# Altium project nPOC-BB_alpha_main-board.PrjPcb (part 1 of 3)
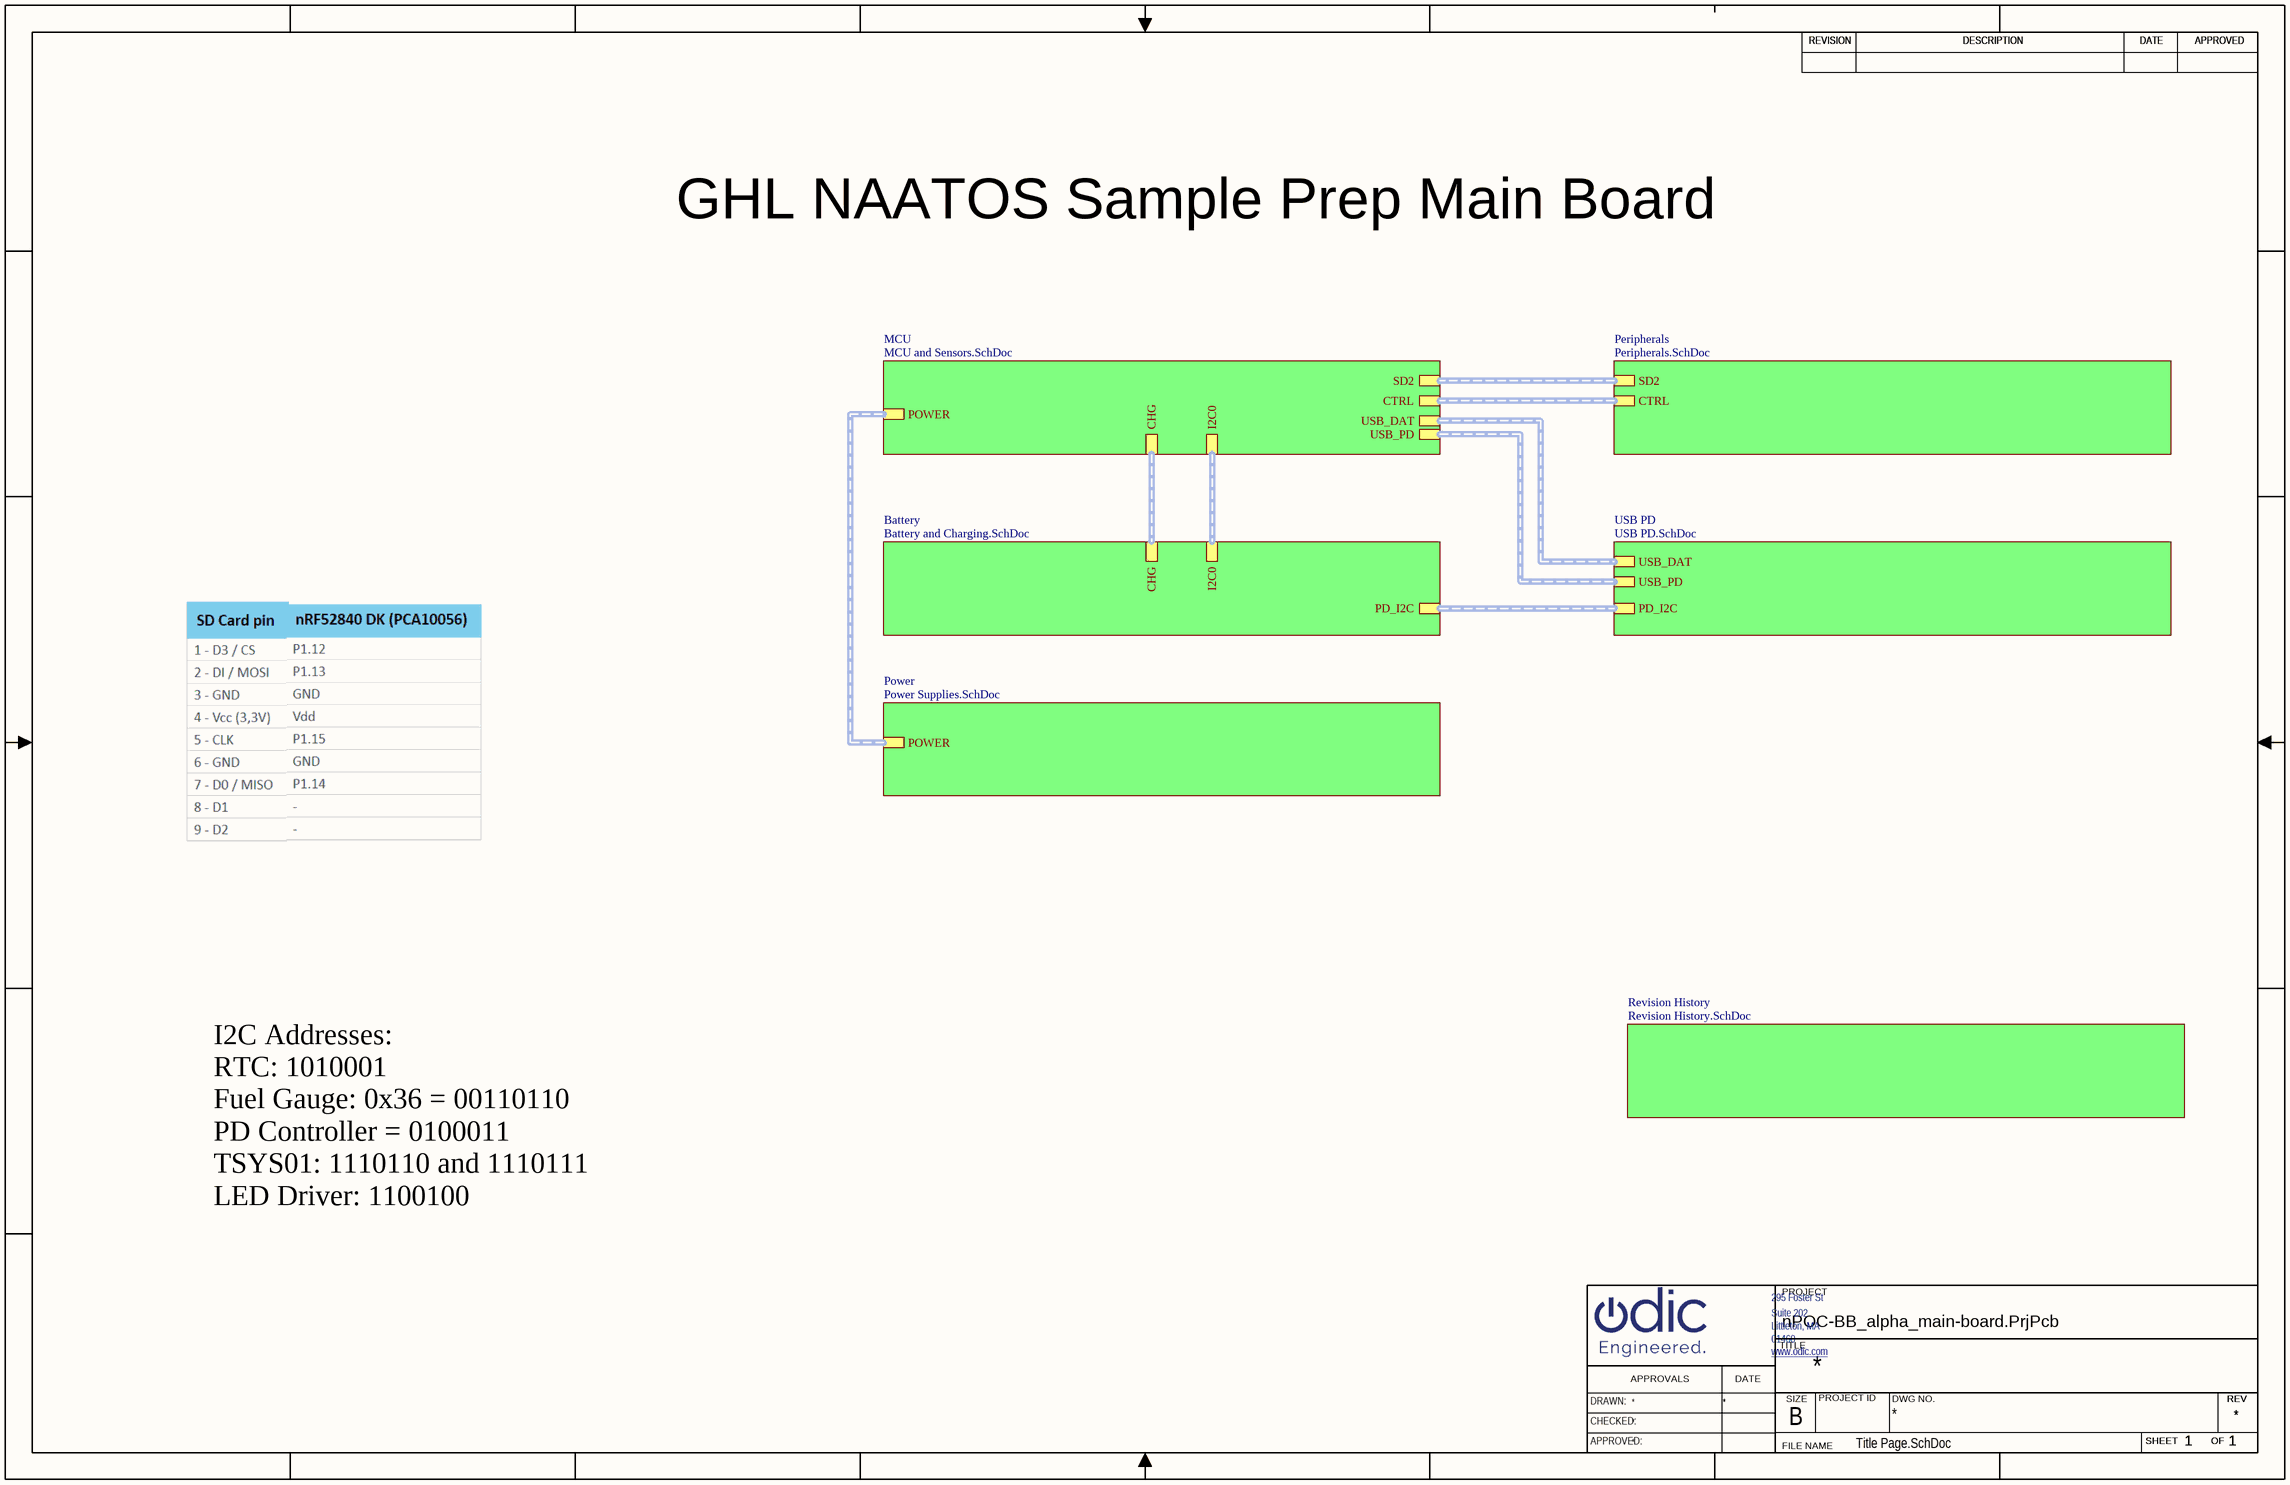
[diagram p0: Title Page.SchDoc]
7 sheets, 195 parts. Net scope: hierarchical (ports join the sheet entries above them; power ports are global).
Board file: nPOC-BB_alpha_main-boardd.PcbDoc
Sheets:
  Title Page.SchDoc
    MCU = MCU and Sensors.SchDoc
    Battery = Battery and Charging.SchDoc
    Revision History = Revision History.SchDoc
    Power = Power Supplies.SchDoc
    Peripherals = Peripherals.SchDoc
    USB PD = USB PD.SchDoc

## Sheet Title Page.SchDoc
size 431 x 279 mm; SheetNumber: 1; SheetTotal: 1

### Sub-sheets
Battery = Battery and Charging.SchDoc: CHG, I2C0, PD_I2C
MCU = MCU and Sensors.SchDoc: CHG, CTRL, POWER, USB_PD, SD2, USB_DAT, I2C0
Peripherals = Peripherals.SchDoc: CTRL, SD2
Power = Power Supplies.SchDoc: POWER
Revision History = Revision History.SchDoc: no entries
USB PD = USB PD.SchDoc: USB_PD, PD_I2C, USB_DAT

### Buses and harness runs
harness sheet Battery/CHG = sheet MCU/CHG
harness sheet Battery/I2C0 = sheet MCU/I2C0
harness sheet Battery/PD_I2C = sheet USB PD/PD_I2C
harness sheet MCU/CTRL = sheet Peripherals/CTRL
harness sheet MCU/POWER = sheet Power/POWER
harness sheet MCU/SD2 = sheet Peripherals/SD2
harness sheet MCU/USB_DAT = sheet USB PD/USB_DAT
harness sheet MCU/USB_PD = sheet USB PD/USB_PD

### Notes on the sheet
- GHL NAATOS Sample Prep Main Board
- I2C Addresses:
  RTC: 1010001
  Fuel Gauge: 0x36 = 00110110
  PD Controller = 0100011
  TSYS01: 1110110 and 1110111
  LED Driver: 1100100
- REVISION
- DESCRIPTION
- DATE
- APPROVED
- 295 Foster St
- PROJECT
- www.odic.com <http://www.odic.com>
- Littleton, MA
- 01460
- Suite 202
- TITLE
- DRAWN:
- CHECKED:
- APPROVALS
- SIZE
- B
- PROJECT ID
- DWG NO.
- SHEET
- OF
- REV
- APPROVED:
- FILE NAME

## Sheet MCU and Sensors.SchDoc: MCU and Sensors
size 431 x 279 mm; DrawnBy: DD; DocumentNumber: GHL-1-21002; Revision: A; SheetNumber: 2; SheetTotal: 7; ProjectID: 263-03
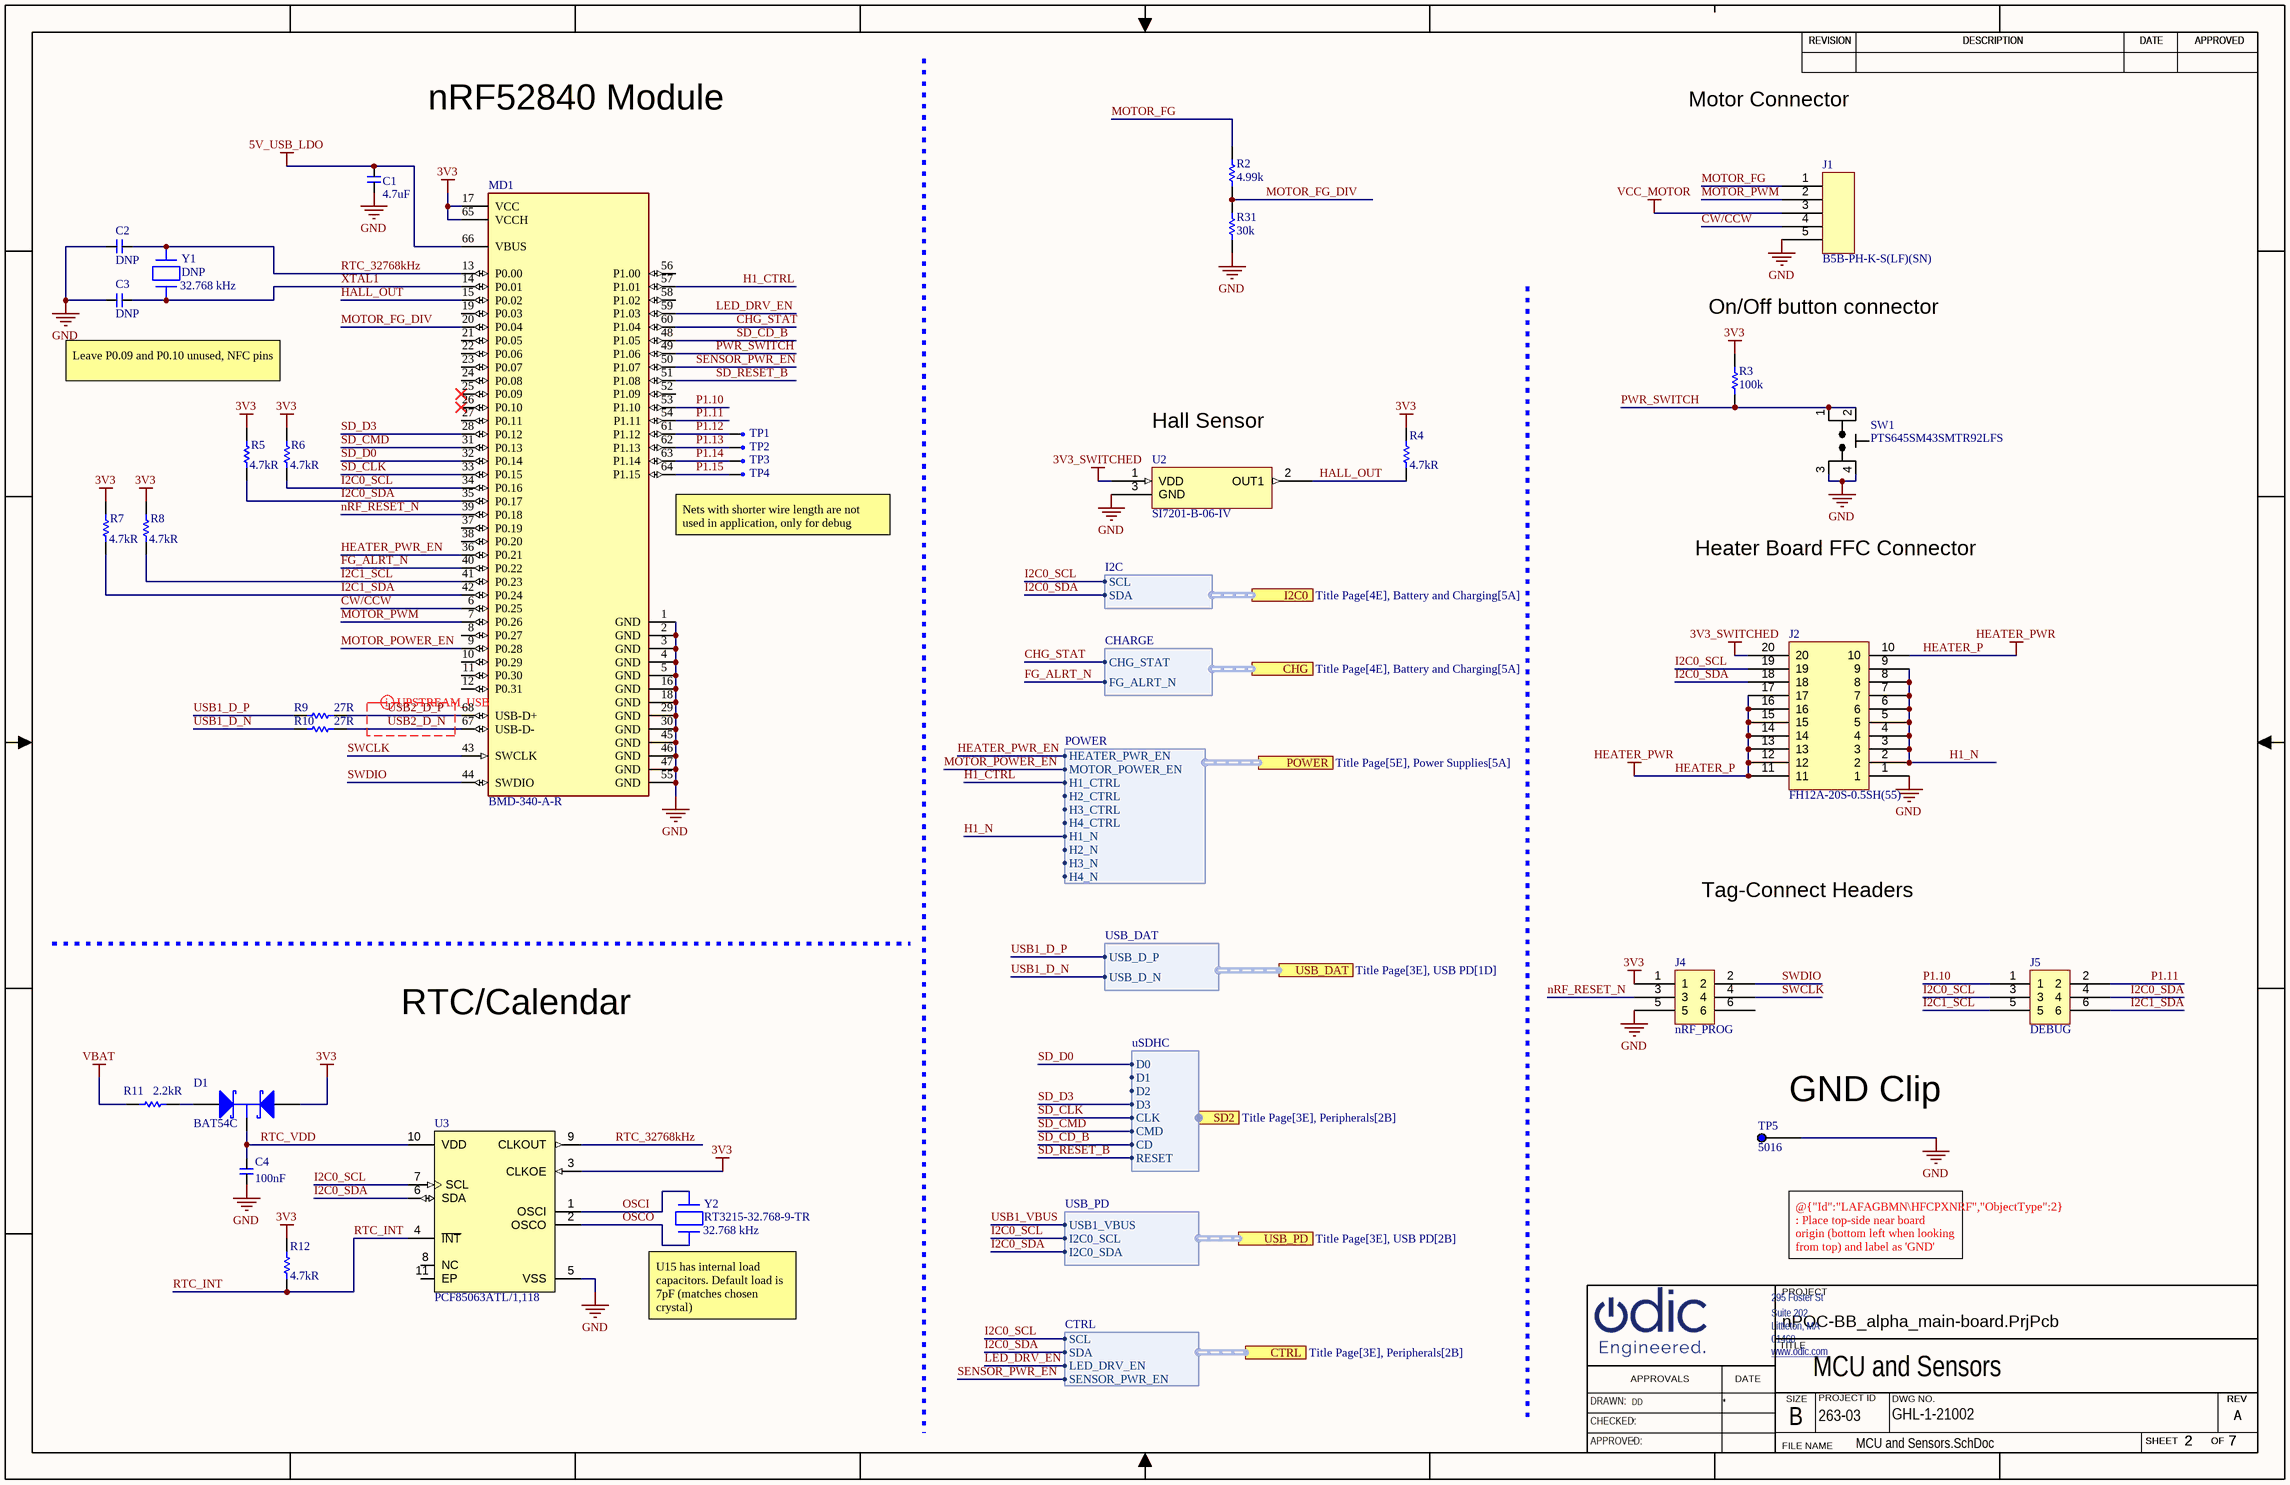
[diagram p1: MCU and Sensors.SchDoc]

### Parts
C1  4.7uF  [C0603]
C2  DNP  [C0402]
C3  DNP  [C0402]
C4  Capacitance: 100nF  [C0402]  (hidden comment: C0402_100n_16V_10pct)
D1  BAT54C  [SOT23]
J1  B5B-PH-K-S(LF)(SN)  [JST_B5B-PH-K-S]
J2  FH12A-20S-0.5SH(55)  [hirose_fh12a-20s-0p5sh55]
J4  nRF_PROG  [tc2030-mcp-nl]
J5  DEBUG  [tc2030-mcp-nl]
MD1  BMD-340-A-R  [BMD-340-A-R]
R2  4.99k  [R0402]
R3  100k  [R0402]
R4  Resistance: 4.7kR  [R0402]  (hidden comment: R0402_4k7_1pct)
R5  Resistance: 4.7kR  [R0402]  (hidden comment: R0402_4k7_1pct)
R6  Resistance: 4.7kR  [R0402]  (hidden comment: R0402_4k7_1pct)
R7  Resistance: 4.7kR  [R0402]  (hidden comment: R0402_4k7_1pct)
R8  Resistance: 4.7kR  [R0402]  (hidden comment: R0402_4k7_1pct)
R9  27R  [R0402]
R10  27R  [R0402]
R11  Resistance: 2.2kR  [R0402]  (hidden comment: R0402_2k2_5pct)
R12  Resistance: 4.7kR  [R0402]  (hidden comment: R0402_4k7_1pct)
R31  30k  [R0402]
SW1  PTS645SM43SMTR92LFS  [swt_pb_pts645s]
TP1  TPC30  [tpc30]  (value not drawn)
TP2  TPC30  [tpc30]  (value not drawn)
TP3  TPC30  [tpc30]  (value not drawn)
TP4  TPC30  [tpc30]  (value not drawn)
TP5  5016  [KEYSTONE_5016]
U2  SI7201-B-06-IV  [SOT23]
U3  PCF85063ATL/1,118  [dfn10_2p6x2p6_p5mm]
Y1  DNP  Operating Frequency: 32.768 kHz  [xtal2_3p2x1p5]
Y2  RT3215-32.768-9-TR  Operating Frequency: 32.768 kHz  [xtal2_3p2x1p5]

### Ports
CHG (harness CHARGE, see Title Page[4E], Battery and Charging[5A]), CTRL (harness CTRL, see Title Page[3E], Peripherals[2B]), I2C0 (harness I2C, see Title Page[4E], Battery and Charging[5A]), POWER (harness POWER, see Title Page[5E], Power Supplies[5A]), SD2 (harness uSDHC, see Title Page[3E], Peripherals[2B]), USB_DAT (harness USB_DAT, see Title Page[3E], USB PD[1D]), USB_PD (harness USB_PD, see Title Page[3E], USB PD[2B])

### Harnesses
CTRL: SCL, SDA, LED_DRV_EN, SENSOR_PWR_EN
USB_PD: USB1_VBUS, I2C0_SCL, I2C0_SDA
uSDHC: D0, D1, D2, D3, CLK, CMD, CD, RESET
USB_DAT: USB_D_P, USB_D_N
I2C: SCL, SDA
CHARGE: CHG_STAT, FG_ALRT_N
POWER: HEATER_PWR_EN, H1_CTRL, H2_CTRL, H3_CTRL, H4_CTRL, H1_N, H2_N, H3_N, H4_N, MOTOR_POWER_EN

### Nets
3V3: D1.2(A2) J4.1 MD1.17(VCC) MD1.65(VCCH) R3.2 R4.2 R5.2 R6.2 R7.2 R8.2 R12.2 U3.3(CLKOE)
3V3_SWITCHED: J2.20 U2.1(VDD)
5V_USB_LDO: C1.2 MD1.66(VBUS)
GND: C1.1 C2.1 C3.1 C4.2 J1.5 J2.1 J4.5 MD1.1(GND) MD1.2(GND) MD1.3(GND) MD1.4(GND) MD1.5(GND) MD1.16(GND) MD1.18(GND) MD1.29(GND) MD1.30(GND) MD1.45(GND) MD1.46(GND) MD1.47(GND) MD1.55(GND) R31.1 SW1.3 SW1.4 TP5.1 U2.3(GND) U3.5(VSS)
HEATER_P: J2.10 J2.11 J2.12 J2.13 J2.14 J2.15 J2.16 J2.17  [also labelled HEATER_PWR]
VBAT: R11.1
VCC_MOTOR: J1.3
CHG_STAT: MD1.60(P1.04) ; port CHG.CHG_STAT
CW/CCW: J1.4 MD1.6(P0.25)
FG_ALRT_N: MD1.40(P0.22) ; port CHG.FG_ALRT_N
H1_CTRL: MD1.57(P1.01) ; port POWER.H1_CTRL
H1_N: J2.2 J2.3 J2.4 J2.5 J2.6 J2.7 J2.8 J2.9 ; port POWER.H1_N
HALL_OUT: MD1.15(P0.02) R4.1 U2.2(OUT1)
HEATER_PWR_EN: MD1.36(P0.21) ; port POWER.HEATER_PWR_EN
I2C0_SCL: J2.19 J5.3 MD1.34(P0.16) R6.1 U3.7(SCL) ; port CTRL.SCL, port USB_PD.I2C0_SCL, port I2C0.SCL
I2C0_SDA: J2.18 J5.4 MD1.35(P0.17) R5.1 U3.6(SDA) ; port CTRL.SDA, port USB_PD.I2C0_SDA, port I2C0.SDA
I2C1_SCL: J5.5 MD1.41(P0.23) R8.1
I2C1_SDA: J5.6 MD1.42(P0.24) R7.1
LED_DRV_EN: MD1.59(P1.03) ; port CTRL.LED_DRV_EN
MOTOR_FG: J1.1 R2.2
MOTOR_FG_DIV: MD1.20(P0.04) R2.1 R31.2
MOTOR_POWER_EN: MD1.9(P0.28) ; port POWER.MOTOR_POWER_EN
MOTOR_PWM: J1.2 MD1.7(P0.26)
nRF_RESET_N: J4.3 MD1.39(P0.18)
OSCI: U3.1(OSCI) Y2.1
OSCO: U3.2(OSCO) Y2.2
P1.10: J5.1 MD1.53(P1.10)
P1.11: J5.2 MD1.54(P1.11)
P1.12: MD1.61(P1.12) TP1.1
P1.13: MD1.62(P1.13) TP2.1
P1.14: MD1.63(P1.14) TP3.1
P1.15: MD1.64(P1.15) TP4.1
PWR_SWITCH: MD1.49(P1.06) R3.1 SW1.1 SW1.2
RTC_32768kHz: C2.2 MD1.13(P0.00) U3.9(CLKOUT) Y1.1
RTC_INT: R12.1 U3.4(~{INT})
RTC_VDD: C4.1 D1.3(K) U3.10(VDD)
SD_CD_B: MD1.48(P1.05) ; port SD2.CD  [project net SD2_CD_B]
SD_CLK: MD1.33(P0.15) ; port SD2.CLK  [project net SD2_CLK]
SD_CMD: MD1.31(P0.13) ; port SD2.CMD  [project net SD2_CMD]
SD_D0: MD1.32(P0.14) ; port SD2.D0  [project net SD2_D0]
SD_D3: MD1.28(P0.12) ; port SD2.D3  [project net SD2_D3]
SD_RESET_B: MD1.51(P1.08) ; port SD2.RESET  [project net SD2_RESET_B]
SENSOR_PWR_EN: MD1.50(P1.07) ; port CTRL.SENSOR_PWR_EN
SWCLK: J4.4 MD1.43(SWCLK)
SWDIO: J4.2 MD1.44(SWDIO)
USB1_D_N: R10.1 ; port USB_DAT.USB_D_N
USB1_D_P: R9.1 ; port USB_DAT.USB_D_P
USB1_VBUS: port USB_PD.USB1_VBUS
USB2_D_N: MD1.67(USB-D-) R10.2
USB2_D_P: MD1.68(USB-D+) R9.2
XTAL1: C3.2 MD1.14(P0.01) Y1.2
NetD1_1: D1.1(A1) R11.2

Not connected (* = marked no-connect by the designer): J4 6; MD1 8(P0.27) 10(P0.29) 11(P0.30) 12(P0.31) 19(P0.03) 21(P0.05) 22(P0.06) 23(P0.07) 24(P0.08) 25(P0.09)* 26(P0.10)* 27(P0.11) 37(P0.19) 38(P0.20) 52(P1.09) 56(P1.00) 58(P1.02); U3 8(NC) 11(EP)

### Layout directives
differential pair: USB2_D_N, USB2_D_P

### Notes on the sheet
- nRF52840 Module
- Motor Connector
- On/Off button connector
- Leave P0.09 and P0.10 unused, NFC pins
- (near U2) Hall Sensor
- Nets with shorter wire length are not used in application, only for debug
- Heater Board FFC Connector
- Tag-Connect Headers
- RTC/Calendar
- (near TP5) GND Clip
- @{"Id":"LAFAGBMN\HFCPXNRF","ObjectType":2} : Place top-side near board origin (bottom left when looking from top) and label as 'GND' with silk
- (near Y2) U15 has internal load capacitors. Default load is 7pF (matches chosen crystal)
- REVISION
- DESCRIPTION
- DATE
- APPROVED
- 295 Foster St
- PROJECT
- www.odic.com <http://www.odic.com>
- Littleton, MA
- 01460
- Suite 202
- TITLE
- DRAWN:
- CHECKED:
- APPROVALS
- SIZE
- B
- PROJECT ID
- DWG NO.
- SHEET
- OF
- REV
- APPROVED:
- FILE NAME

### Library data of the parts
C1 = CMP-00579-3: CAP CER 4.7UF 25V X5R 0603; Dielectric Material: Ceramic; Tolerance: 20%; Install: POP; Case Code (Imperial): 0603; Case Code (Metric): 1608; Value: 4.7uF; Case/Package: 0603; Radiation Hardening: No; Voltage Rating (DC): 25V; Width: 0.031inch; Min Operating Temperature: -55°C; Depth: 0.8mm; Mounting Technology: Surface Mount; Max Operating Temperature: 85°C; RoHS Compliant: Yes; Weight: 7.1E-05oz; Length: 1.6mm; Height: 0.8mm; Package Quantity: 1; Dielectric: X5R; Termination: SMD/SMT; Voltage Rating: 25V; Reach SVHC Compliant: Unknown; Series: C; Thickness: 0.039inch; Packaging: Tape and Reel; Lead Free: Lead Free
C2 C3 = CMP-00017-6: Blank pads for future cap placements; Install: DNP; Odic Footprint: C0402
C4 = CMP-00301-3: 0.1 µF ±10% 16V Ceramic Capacitor X7R 0402 (1005 Metric); Install: POP; Voltage: 16V; Voltage Rating (DC): 16V; Case/Package: 0402; RoHS Compliant: Yes; Dielectric Material: Ceramic; Package Quantity: 1; Dielectric: X7R; Termination: SMD/SMT; Depth: 0.5mm; Radiation Hardening: No; Construction: Flat; Tolerance: 10%; Case Code (Imperial): 0402; Voltage Rating: 16V; Max Operating Temperature: 125°C; Length: 1mm; Lead Free: Lead Free; REACH SVHC: No SVHC; Packaging: Tape and Reel; Mount: Surface Mount,PCB; Series: -; Case Code (Metric): 1005; Min Operating Temperature: -55°C; Width: 0.02inch; Thickness: 0.022inch; Height: 0.56mm; Contact Plating: Tin,Matte
D1 = CMP-00811-2: Diode array, 1 pair. Common cathode. Small Signal Schottky 30V 0.2A 5ns Automotive 3-Pin SOT-23 T/R; Diode capacitance: 10pF; Peak Forward Current: 300mA; Forward Current: 200mA; Install: POP; Pins: 3; RoHS Compliant: Yes; Case/Package: SOT-23-3; Lead Free: Lead Free; Max Operating Temperature: 150°C; Packaging: Tape and Reel; Min Operating Temperature: -55°C; Reverse Voltage: 30V
J1 = CMP-00704-3: Connector Header, PH Series, 5 Position, 2.00mm, Through Hole, Press-Fit, Solder, Natural; Number of Positions: 5; Max Voltage Rating (AC): 100V; Pitch: 2mm; Insulation Resistance: 1MR; Max Current Rating: 2A; Mated Stacking Heights: 8mm; Install: POP; Contact Resistance: 20mR; Length: 11.9mm; Depth: 4.5mm; Mounting Technology: Through Hole; Insulation Material: Nylon; Insulation Color: Natural; Orientation: Straight; Series: PH; Height: 9.4mm; Pins: 5; Contact Shape: Square; Termination: Solder; Contact Finish - Mating: TIN; Number of Rows: 1; Number of Contacts: 5; Contact Type: Male Pin; Reach SVHC Compliant: No; Number of Poles: 5; Voltage Rating: 100V; Contact Plating: Tin,Copper; Min Operating Temperature: -25°C; Voltage Rating (AC): 100V; Width: 4.5mm; Lead Pitch: 2mm; Current Rating: 2A; Working Voltage: 100V; Contact Material: Brass,Tin; Max Operating Temperature: 85°C; Housing Color: White; Lead Free: Lead Free; Connector Type: Header; Packaging: Bulk; Fastening Type: Detent; Flammability Rating: UL94 V-0; Housing Material: Polyamide
J2 = CMP-00932-3: Connectors for Connecting - 0.5/1-mm Pitch FPC/FFC - FH12 Series (HIROSE ELECTRIC); Current Rating: 500mA; Voltage Rating (AC): 50V; Number of Positions: 20; Actuator Color: Brown; Gender: Female; Contact Location: Top; Wire/Cable Type: Straight; Actuator Material: Polyphenylene; Contact Resistance: 50mR; Max Current Rating: 400mA; Install: POP; Pitch: 0.5mm; Insulation Resistance: 500MR; Housing Material: Polyamide; Reach SVHC Compliant: No; Housing Color: Beige; Radiation Hardening: No; Min Operating Temperature: -40°C; Packaging: Tape and Reel; Max Operating Temperature: 70°C; Termination: Solder; Mounting Technology: Surface Mount; Flammability Rating: UL94 V-0; Mating Cycles: 20; Color: Beige,Brown; Lead Pitch: 0.5mm; Max Voltage Rating (AC): 50V; Orientation: Right Angle; RoHS Compliant: Yes; Voltage Rating: 50V; Material: Polyamide; Lead Free: Lead Free; Package Quantity: 2000; Contact Plating: Gold; Series: FH12; Length: 14.5mm; Number of Contacts: 20; Number of Rows: 1; Contact Material: Bronze; Width: 14.1mm; Depth: 6.2mm
J4 J5 = CMP-00144-9: 6 Pin Tag-Connect Header Footprint. Pads.; Install: DNP
MD1 = CMP-002-000005-3: BMD-340 Series 3.6 V 2.5 GHz -96 dBm Stand-Alone Bluetooth 5 Low Energy Module; Data Rate: 2Mbps; Memory Size: 256KB; MP: BMD-330-A-R; Sensitivity: -103dBm; Current - Transmitting: 26.7mA; Interface: I2C,SPI,UART; Frequency: 2.5GHz; Current - Receiving: 11.7mA; Install: POP; Series: BMD-34; Package: None; Price: None; Source: BMD-330-A-R.SchLib; RoHS Compliant: Yes; Min Operating Temperature: -40°C; Max Operating Temperature: 85°C; Design Item ID: BMD-330-A-R; Case/Package: Module; Packaging: Tape and Reel; Mounting Technology: Surface Mount
R2 = CMP-00381-1: Res General Purpose Thick Film 0402 4.99K Ohm 1% 1/16W ±100ppm/°C Molded SMD Paper T/R; Install: POP; Max Power Dissipation: 63mW; Voltage Rating (DC): 50V; Resistance: 4.99kR; Power Rating: 62.5mW; Max Operating Temperature: 155°C; Width: 0.02inch; Series: RC; Case/Package: 0402; Number of Terminations: 2; Package Quantity: 1; Voltage Rating: 50V; Packaging: Tape and Reel; Features: Moisture Resistant; Construction: Rectangular; Resistor Type: Thick Film; Case Code (Imperial): 0402; Case Code (Metric): 1005; Tolerance: 1%; Height: 0.016inch; Min Operating Temperature: -55°C; RoHS Compliant: Yes; Termination: SMD/SMT; Reach SVHC Compliant: Yes; Lead Free: Lead Free; Size Code: 0402; Military Standard: Not; Temperature Coefficient: 100ppm/°C; Resistance Tolerance: 1%; Length: 1mm; Depth: 0.5mm
R3 = CMP-00351-1: Res General Purpose Thick Film 0402 100K Ohm 1% 1/16W ±100ppm/°C Molded SMD Paper T/R; Working Voltage: 50V; Resistance: 100kR; Install: POP; Power Rating: 63mW; Series: RC; Military Standard: Not; Case Code (Metric): 1005; Features: Moisture Resistant; Termination: SMD/SMT; Number of Terminations: 2; Temperature Coefficient: 100ppm/°C; Height: 0.016inch; Tolerance: 1%; Case/Package: 0402; Depth: 0.5mm; RoHS Compliant: Yes; Resistance Tolerance: 1%; Lead Free: Lead Free; Max Operating Temperature: 155°C; Min Operating Temperature: -55°C; Width: 0.02inch; Packaging: Tape and Reel; Technology: THICK FILM; Case Code (Imperial): 0402; Package Quantity: 1; REACH SVHC: No SVHC; Resistor Type: Thick Film; Max Power Dissipation: 63mW; Voltage Rating: 50V; Length: 0.039inch; Construction: Rectangular
R4-R8 R12 = CMP-00336-2: RES 4.7K OHM 1% 1/16W 0402; Install: POP; Temperature Coefficient: 100ppm/°C; Voltage Rating: 50V; Max Power Dissipation: 63mW; Power Rating: 62.5mW; Features: Moisture Resistant; Length: 1mm; REACH SVHC: No SVHC; RoHS Compliant: Yes; Military Standard: Not; Size Code: 0402; Series: RC; Width: 0.5mm; Lead Free: Lead Free; Max Operating Temperature: 155°C; Height: 0.32mm; Voltage Rating (DC): 50V; Construction: Rectangular; Packaging: Tape and Reel; Tolerance: 1%; Case Code (Metric): 1005; Case Code (Imperial): 0402; Number of Pins: 2; Resistor Type: Thick Film; Number of Terminations: 2; Termination: SMD/SMT; Min Operating Temperature: -55°C; Case/Package: 0402; Height - Seated (Max): 0.016inch; Resistance Tolerance: 1%; Depth: 0.5mm
R9 R10 = CMP-009-00036-1: SMD Chip Resistor, 27 Ohm, ± 1%, 100 mW, 0402 [1005 Metric], Thick Film, Precision; Install: POP; Temperature Coefficient: 100ppm/°C; Power Rating: 100mW; Voltage Rating (DC): 50V; Min Operating Temperature: -55°C; Number of Terminations: 2; Max Operating Temperature: 155°C; Tolerance: 1%; Mounting Technology: Surface Mount; Lead Free: Lead Free; Width: 0.5mm; Package Quantity: 1; Resistor Type: Thick Film; Weight: 2.8E-05oz; Length: 1mm; Technology: THICK FILM; Case Code (Metric): 1005; Series: ERJ; Resistance Tolerance: 1%; Pins: 2; Reach SVHC Compliant: No; Case/Package: 0402; Packaging: Tape and Reel; Height: 0.35mm; Max Power Dissipation: 100mW; Case Code (Imperial): 0402; Value: 27R; Contact Plating: Tin; Features: Automotive AEC-Q200; Voltage Rating: 50V; Depth: 0.5mm; Termination: SMD/SMT; RoHS Compliant: Yes
R11 = CMP-00405-3: Res Thick Film 0402 2.2K Ohm 5% 1/10W +/-200ppm/ßC Molded SMD Punched Carrier T/R; Temperature Coefficient: 200ppm/°C; Max Power Dissipation: 100mW; Install: POP; Voltage Rating: 50V; Width: 0.5mm; Radiation Hardening: No; Ratings: AEC-Q200; Resistor Type: Thick Film; Construction: Rectangular; Packaging: Tape and Reel; Case Code (Metric): 1005; Package Quantity: 10000; Min Operating Temperature: -55°C; Weight: 2.8E-05oz; Height: 0.35mm; Max Operating Temperature: 155°C; Contact Plating: Tin; Case/Package: 0402; Features: Automotive AEC-Q200; Termination: SMD/SMT; Lead Free: Lead Free; Resistance Tolerance: 5%; Reach SVHC Compliant: Yes; Depth: 0.5mm; Length: 1mm; Size Code: 0402; Number of Terminations: 2; Technology: THICK FILM; Power Rating: 100mW; Military Standard: Not; Tolerance: 5%; Series: ERJ; RoHS Compliant: Yes; Voltage Rating (DC): 50V; Case Code (Imperial): 0402; Mount: Surface Mount
R31 = CMP-00457-1: Res General Purpose Thick Film 0402 30k Ohm 1% 1/16W ±100ppm/°C Molded Paper T/R; Power Rating: 63mW; Install: POP; Voltage Rating (DC): 50V; Value: 30kR; Width: 0.5mm; Termination: SMD/SMT; Tolerance: 1%; Min Operating Temperature: -55°C; Max Power Dissipation: 63mW; Packaging: Tape and Reel; Resistance Tolerance: 1%; Lead Free: Lead Free; Max Operating Temperature: 155°C; Series: RC; Length: 1mm; Voltage Rating: 50V; Case/Package: 0402; Weight: 2.3E-05oz; Height: 0.35mm; Case Code (Metric): 1005; Number of Terminations: 2; Military Standard: Not; RoHS Compliant: Yes; Depth: 0.5mm; Features: Moisture Resistant; Case Code (Imperial): 0402; Construction: Rectangular; Resistor Type: Thick Film; Temperature Coefficient: 100ppm/°C
SW1 = CMP-011-00000-2: Switch Tactile N.O. SPST Round Button Gull Wing 0.05A 12VDC 100000Cycles 1.57N SMD T/R; Actuator Type: Standard; Operating Force: 160gf; Number of Positions: 2; Illumination Type: Non-Illuminated,Illuminated; Actuator Material: Nylon,Polyamide,PA66; Max Current Rating: 50mA; Actuator Length: 0.85mm; Switch Function: Off-Mom; Install: POP; Max Voltage Rating (DC): 12V; Contact Resistance: 100mR; Contact Material: Silver; Size: 6mm; Min Operating Temperature: -20°C; RoHS Compliant: Yes; Depth: 9mm; Contact Plating: Silver; Lead Free: Lead Free; Case/Package: SMD/SMT; Length: 6mm; Termination: Gull Wing; Max Operating Temperature: 60°C; Throw Configuration: SPST; Orientation: Straight; Mounting Technology: Surface Mount; Current Rating: 50mA; Contact Current Rating: 50mA; Mechanical Life: 100000Cycles; Packaging: Tape and Reel; Package Quantity: 1; Voltage Rating (DC): 12V; Color: Black; Reach SVHC Compliant: No; Series: PTS645
TP1-TP4 = CMP-00021-3: Test Point Circle 30; Install: DNP
TP5 = CMP-00809-3: Test point clip, SMT Phos Bronze/Silver 1000pc Tape & Reel; Install: DNP; Number of Ports: 1; Length: 3.81mm; Insulation Material: Polycarbonate; Series: -; Depth: 2.48mm; Material: Bronze,Silver; Contact Material: Bronze; Packaging: Tape and Reel; Color: White; Number of Contacts: 1; Orientation: Straight; Package Quantity: 1; RoHS Compliant: Yes; Reach SVHC Compliant: No; Termination: Solder; Height: 0.09inch; Mounting Technology: Surface Mount; Contact Plating: Silver; Lead Free: Lead Free
U2 = CMP-00881-2: Switch/Latch Hall Effect Magnetic Position Sensor, SOT23-3, -40 to 125°C, RoHS; Install: POP; Max Supply Current: 400nA; Packaging: Strip; RoHS Compliant: Yes; Series: -; Mounting Technology: Surface Mount; Min Operating Temperature: -40°C; Case/Package: SOT-23-3; Max Operating Temperature: 125°C
U3 = CMP-00812-3: IC RTC CLK/CALENDAR I2C 10-SON; Time Format: HH:MM:SS; Logic Function: Clock; Min Supply Voltage: 900mV; Date Format: Binary; Max Supply Voltage: 5.5V; Reach SVHC Compliant: No; Package Quantity: 4000; Pins: 10; Radiation Hardening: No; Interface: I2C; Max Operating Temperature: 85°C; Mounting Technology: Surface Mount; Case/Package: DFN EP; Lead Free: Lead Free; Min Operating Temperature: -40°C; Packaging: Tape and Reel; RoHS Compliant: Yes
Y1 = CMP-00624-3: RT3215 Series 0.032768 ±20 ppm 9pF -40°C TO +85°C SMT Tuning Fork Crystal; Value: 9E-12F; Frequency Tolerance: 20ppm; RoHS Compliant: Yes; Min Operating Temperature: -40°C; Max Operating Temperature: 85°C; Lead Free: Lead Free; Load Capacitance: 9pF; Install: DNP
Y2 = CMP-00624-3: RT3215 Series 0.032768 ±20 ppm 9pF -40°C TO +85°C SMT Tuning Fork Crystal; Value: 9E-12F; Frequency Tolerance: 20ppm; Install: POP; RoHS Compliant: Yes; Min Operating Temperature: -40°C; Max Operating Temperature: 85°C; Lead Free: Lead Free; Load Capacitance: 9pF

## Sheet Battery and Charging.SchDoc: Battery and Charging
size 431 x 279 mm; DrawnBy: DD; DocumentNumber: GHL-1-21002; Revision: A; SheetNumber: 3; SheetTotal: 7; ProjectID: 263-03
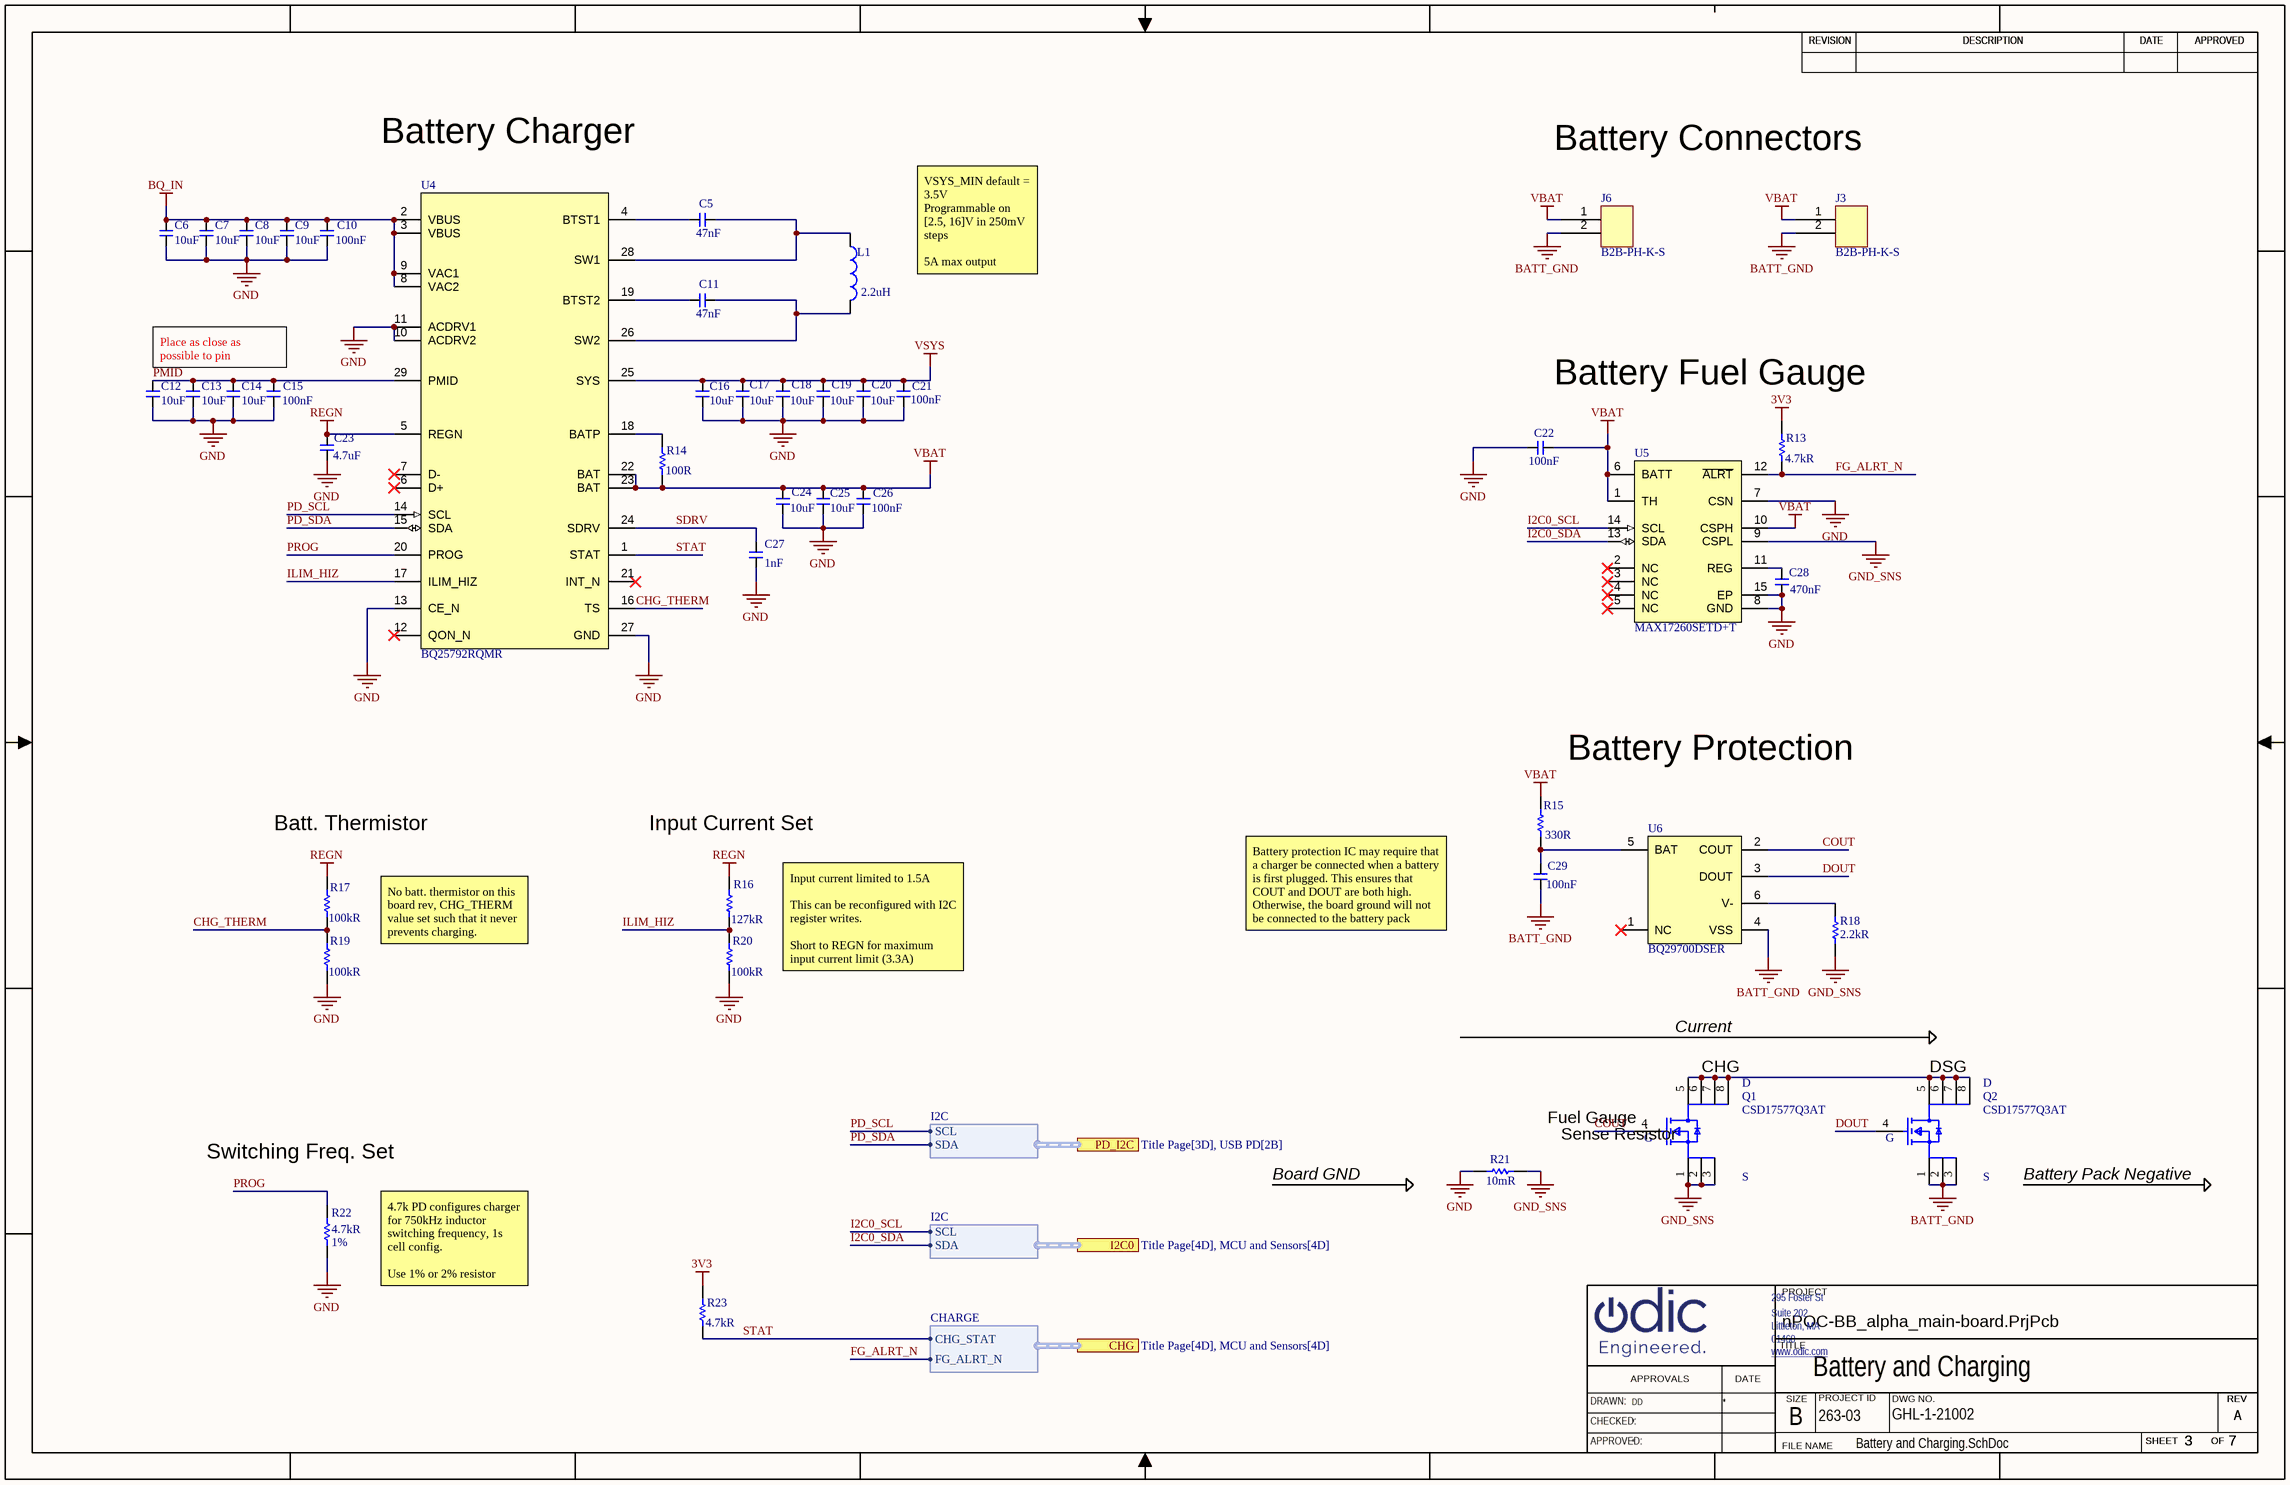
[diagram p2: Battery and Charging.SchDoc]

### Parts
C5  Capacitance: 47nF  [C0402]  (hidden comment: C0402_47n_50V_10pct)
C6  Capacitance: 10uF  [C0603]  (hidden comment: C0603_10u_25V_10pct)
C7  Capacitance: 10uF  [C0603]  (hidden comment: C0603_10u_25V_10pct)
C8  Capacitance: 10uF  [C0603]  (hidden comment: C0603_10u_25V_10pct)
C9  Capacitance: 10uF  [C0603]  (hidden comment: C0603_10u_25V_10pct)
C10  Capacitance: 100nF  [C0402]  (hidden comment: C0402_0u1_25V_10pct)
C11  Capacitance: 47nF  [C0402]  (hidden comment: C0402_47n_50V_10pct)
C12  Capacitance: 10uF  [C0603]  (hidden comment: C0603_10u_25V_10pct)
C13  Capacitance: 10uF  [C0603]  (hidden comment: C0603_10u_25V_10pct)
C14  Capacitance: 10uF  [C0603]  (hidden comment: C0603_10u_25V_10pct)
C15  Capacitance: 100nF  [C0402]  (hidden comment: C0402_0u1_25V_10pct)
C16  Capacitance: 10uF  [C0603]  (hidden comment: C0603_10u_25V_10pct)
C17  Capacitance: 10uF  [C0603]  (hidden comment: C0603_10u_25V_10pct)
C18  Capacitance: 10uF  [C0603]  (hidden comment: C0603_10u_25V_10pct)
C19  Capacitance: 10uF  [C0603]  (hidden comment: C0603_10u_25V_10pct)
C20  Capacitance: 10uF  [C0603]  (hidden comment: C0603_10u_25V_10pct)
C21  Capacitance: 100nF  [C0402]  (hidden comment: C0402_0u1_25V_10pct)
C22  Capacitance: 100nF  [C0402]  (hidden comment: C0402_100n_16V_10pct)
C23  Capacitance: 4.7uF  [C0402]  (hidden comment: C0402_4u7_10V_20pct)
C24  Capacitance: 10uF  [C0603]  (hidden comment: C0603_10u_25V_10pct)
C25  Capacitance: 10uF  [C0603]  (hidden comment: C0603_10u_25V_10pct)
C26  Capacitance: 100nF  [C0402]  (hidden comment: C0402_0u1_25V_10pct)
C27  Capacitance: 1nF  [C0402]  (hidden comment: C0402_1n_50V_10pct)
C28  Capacitance: 470nF  [C0402]  (hidden comment: C0402_470n_6V3_10pct)
C29  Capacitance: 100nF  [C0402]  (hidden comment: C0402_100n_16V_10pct)
J3  B2B-PH-K-S  [JST_B2B-PH-K-S]
J6  B2B-PH-K-S  [JST_B2B-PH-K-S]
L1  value 2.2uH  [ind2_5p4x5p2mm]  (hidden comment: 0530CDMCCDS-2R2MC)
Q1  CSD17577Q3AT  [dfn8_3p1x3p25_p65mm]
Q2  CSD17577Q3AT  [dfn8_3p1x3p25_p65mm]
R13  Resistance: 4.7kR  [R0402]  (hidden comment: R0402_4k7_1pct)
R14  value 100R  [R0402]  (hidden comment: R0402_100R_1pct)
R15  value 330R  [R0402]  (hidden comment: R0402_300R_1pct)
R16  value 127kR  [R0402]  (hidden comment: R0402_127k_1pct)
R17  Resistance: 100kR  [R0402]  (hidden comment: R0402_100k_1pct)
R18  Resistance: 2.2kR  [R0402]  (hidden comment: R0402_2k2_5pct)
R19  Resistance: 100kR  [R0402]  (hidden comment: R0402_100k_1pct)
R20  Resistance: 100kR  [R0402]  (hidden comment: R0402_100k_1pct)
R21  value 10mR  [R0603]  (hidden comment: R0603_0R01_1pct)
R22  Resistance Tolerance: 1%  Resistance: 4.7kR  [R0402]  (hidden comment: R0402_4k7_1pct)
R23  Resistance: 4.7kR  [R0402]  (hidden comment: R0402_4k7_1pct)
U4  BQ25792RQMR  [qfn29_4x4_p4mm-RQM0029A]
U5  MAX17260SETD+T  [dfn14_3x3_p4mm]
U6  BQ29700DSER  [dfn6_1p5x1p5_p5mm]

### Ports
CHG (harness CHARGE, see Title Page[4D], MCU and Sensors[4D]), I2C0 (harness I2C, see Title Page[4D], MCU and Sensors[4D]), PD_I2C (harness I2C, see Title Page[3D], USB PD[2B])

### Harnesses
CHARGE: CHG_STAT, FG_ALRT_N
I2C: SCL, SDA

### Nets
3V3: R13.2 R23.2
BATT_GND: C29.1 J3.2 J6.2 Q2.1(S) Q2.2(S) Q2.3(S) U6.4(VSS)
BQ_IN: C6.2 C7.2 C8.2 C9.2 C10.2 U4.2(VBUS) U4.3(VBUS) U4.8(VAC2) U4.9(VAC1)
GND: C6.1 C7.1 C8.1 C9.1 C10.1 C12.1 C13.1 C14.1 C15.1 C16.1 C17.1 C18.1 C19.1 C20.1 C21.1 C22.2 C23.1 C24.1 C25.1 C26.1 C27.1 C28.1 R19.1 R20.1 R21.1 R22.1 U4.10(ACDRV2) U4.11(ACDRV1) U4.13(CE_N) U4.27(GND) U5.7(CSN) U5.8(GND) U5.15(EP)
GND_SNS: Q1.1(S) Q1.2(S) Q1.3(S) R18.2 R21.2 U5.9(CSPL)
REGN: C23.2 R16.2 R17.2 U4.5(REGN)
VBAT: C22.1 C24.2 C25.2 C26.2 J3.1 J6.1 R14.1 R15.2 U4.22(BAT) U4.23(BAT) U5.1(TH) U5.6(BATT) U5.10(CSPH)
VSYS: C16.2 C17.2 C18.2 C19.2 C20.2 C21.2 U4.25(SYS)
CHG_THERM: R17.1 R19.2 U4.16(TS)
COUT: Q1.4(G) U6.2(COUT)
DOUT: Q2.4(G) U6.3(DOUT)
FG_ALRT_N: R13.1 U5.12(~{ALRT}) ; port CHG.FG_ALRT_N
I2C0_SCL: U5.14(SCL) ; port I2C0.SCL
I2C0_SDA: U5.13(SDA) ; port I2C0.SDA
ILIM_HIZ: R16.1 R20.2 U4.17(ILIM_HIZ)
PD_SCL: U4.14(SCL) ; port PD_I2C.SCL
PD_SDA: U4.15(SDA) ; port PD_I2C.SDA
PMID: C12.2 C13.2 C14.2 C15.2 U4.29(PMID)
PROG: R22.2 U4.20(PROG)
SDRV: C27.2 U4.24(SDRV)
STAT: R23.1 U4.1(STAT) ; port CHG.CHG_STAT  [project net CHG_STAT]
NetC5_1: C5.1 L1.1 U4.28(SW1)
NetC5_2: C5.2 U4.4(BTST1)
NetC11_1: C11.1 L1.2 U4.26(SW2)
NetC11_2: C11.2 U4.19(BTST2)
NetC28_2: C28.2 U5.11(REG)
NetC29_2: C29.2 R15.1 U6.5(BAT)
NetQ1_5: Q1.5(D) Q1.6(D) Q1.7(D) Q1.8(D) Q2.5(D) Q2.6(D) Q2.7(D) Q2.8(D)
NetR14_2: R14.2 U4.18(BATP)
NetR18_1: R18.1 U6.6(V-)

Not connected (* = marked no-connect by the designer): U4 6(D+)* 7(D-)* 12(QON_N)* 21(INT_N)*; U5 2(NC)* 3(NC)* 4(NC)* 5(NC)*; U6 1(NC)*

### Notes on the sheet
- Battery Charger
- Battery Connectors
- VSYS_MIN default = 3.5V
  Programmable on [2.5, 16]V in 250mV steps
  5A max output
- Place as close as possible to pin
- Battery Fuel Gauge
- (near R15) Battery Protection
- Batt. Thermistor
- Input Current Set
- No batt. thermistor on this board rev, CHG_THERM value set such that it never prevents charging.
- Input current limited to 1.5A
  This can be reconfigured with I2C register writes.
  Short to REGN for maximum input current limit (3.3A)
- Battery protection IC may require that a charger be connected when a battery is first plugged. This ensures that COUT and DOUT are both high. Otherwise, the board ground will not be connected to the battery pack negative
- Current
- (near Q1) CHG
- (near Q2) DSG
- Switching Freq. Set
- (near R21) Fuel Gauge
- (near R21) Sense Resistor
- Board GND
- Battery Pack Negative
- 4.7k PD configures charger for 750kHz inductor switching frequency, 1s cell config.
  Use 1% or 2% resistor
- REVISION
- DESCRIPTION
- DATE
- APPROVED
- 295 Foster St
- PROJECT
- www.odic.com <http://www.odic.com>
- Littleton, MA
- 01460
- Suite 202
- TITLE
- DRAWN:
- CHECKED:
- APPROVALS
- SIZE
- B
- PROJECT ID
- DWG NO.
- SHEET
- OF
- REV
- APPROVED:
- FILE NAME

### Library data of the parts
C5 C11 = CMP-00644-3: CGA2B3X7R1H473K050BB; Voltage Rating (DC): 50V; Tolerance: 10%; Dielectric: X7R; Install: POP; Weight: 2.3E-05oz; Case Code (Metric): 1005; Min Operating Temperature: -55°C; Width: 0.02inch; RoHS Compliant: Yes; Thickness: 0.022inch; Ratings: AEC-Q200; Case/Package: 0402; Reach SVHC Compliant: No; Lead Free: Lead Free; Construction: Flat; Mount: Surface Mount; Depth: 0.5mm; Max Operating Temperature: 125°C; Voltage Rating: 50V; Packaging: Tape and Reel; Package Quantity: 1; Series: CGA; Termination: SMD/SMT; Height: 0.5mm; Length: 1mm; Case Code (Imperial): 0402
C6-C9 C12-C14 C16-C20 C24 C25 = CMP-00643-2: GRM188R61E106KA73J; Tolerance: 10%; Voltage Rating: 25V; Install: POP; Case/Package: 0603; RoHS Compliant: Yes; Mount: Surface Mount; Max Operating Temperature: 85°C; Min Operating Temperature: -55°C; Series: GRM
C10 C15 C21 C26 = CMP-00369-1: Cap Ceramic 0.1uF 25V X5R 10% Pad SMD 0402 Multi Layer Ceramic Capacitor (MLCC); Install: POP; Packaging: Tape and Reel; Construction: Flat; Max Operating Temperature: 85°C; Case Code (Metric): 1005; Voltage Rating (DC): 25V; Min Operating Temperature: -55°C; Height: 0.5mm; Series: CL; Case/Package: 0402; Voltage: 25V; Package Quantity: 1; Radiation Hardening: No; Depth: 0.5mm; Thickness: 0.022inch; Lead Free: Lead Free; Tolerance: 10%; Length: 1mm; Mount: Surface Mount; Width: 0.02inch; Dielectric: X5R; RoHS Compliant: Yes; Voltage Rating: 25V; Case Code (Imperial): 0402
C22 C29 = CMP-00301-3: as C4 on sheet MCU and Sensors; Voltage: 16V; Voltage Rating (DC): 16V; Case/Package: 0402; RoHS Compliant: Yes; Dielectric Material: Ceramic; Package Quantity: 1; Dielectric: X7R; Termination: SMD/SMT; Depth: 0.5mm; Radiation Hardening: No; Construction: Flat; Tolerance: 10%; Case Code (Imperial): 0402; Voltage Rating: 16V; Max Operating Temperature: 125°C; Length: 1mm; Lead Free: Lead Free; REACH SVHC: No SVHC; Packaging: Tape and Reel; Mount: Surface Mount,PCB; Series: -; Case Code (Metric): 1005; Min Operating Temperature: -55°C; Width: 0.02inch; Thickness: 0.022inch; Height: 0.56mm; Contact Plating: Tin,Matte
C23 = CMP-00316-1: Cap Ceramic 4.7uF 10V X5R 20% SMD 0402 85°C Paper T/R; Install: POP; Width: 0.02inch; Package Quantity: 10000; Min Operating Temperature: -55°C; Mount: Surface Mount; Case Code (Imperial): 0402; Case/Package: 0402; Series: CL; Packaging: Cut Tape; Length: 0.039inch; Dielectric: X5R; Voltage Rating: 10V; Thickness: 0.022inch; Tolerance: 20%; Max Operating Temperature: 85°C; RoHS Compliant: Yes; Case Code (Metric): 1005; Lead Free: Lead Free
C27 = CMP-00366-1: 0402 1 nF 50V ±10 % Tolerance X7R Surface Mount Multilayer Ceramic Capacitor; Dissipation Factor: 2.5%; Install: POP; Tolerance: 10%; Insulation Resistance: 100GR; RoHS Compliant: Yes; Termination: SMD/SMT; Radiation Hardening: No; Length: 1mm; Contact Plating: Tin,Matte; Voltage Rating (DC): 50V; Thickness: 0.022inch; Case/Package: 0402; Height: 0.56mm; Mount: Surface Mount; Series: -; Construction: Flat; Lead Free: Lead Free; Case Code (Metric): 1005; Reach SVHC Compliant: Yes; Max Operating Temperature: 125°C; Width: 0.02inch; Depth: 0.5mm; Packaging: Tape and Reel; Number of Pins: 2; Voltage: 50V; Package Quantity: 1; Min Operating Temperature: -55°C; Dielectric: X7R; Voltage Rating: 50V; Case Code (Imperial): 0402
C28 = CMP-00343-1: Ceramic capacitor SMD-0402 470nF /6, 3V X5R# K +-10%, Samsung, RoHS; Dielectric: X5R; Voltage Rating: 6.3V; Install: POP; Tolerance: 10%; Height: 0.5mm; Case/Package: 0402; Contact Plating: Tin; Series: CL; Voltage Rating (DC): 6.3V; Lead Free: Lead Free; Mount: Surface Mount; Width: 0.02inch; Length: 1mm; Voltage: 6.3V; Thickness: 0.022inch; Package Quantity: 1; Case Code (Metric): 1005; Packaging: Tape and Reel; Radiation Hardening: No; Min Operating Temperature: -55°C; Depth: 0.5mm; Case Code (Imperial): 0402; RoHS Compliant: Yes; Construction: Flat; Max Operating Temperature: 85°C
J3 J6 = CMP-00685-3: Connector Header, PH Series, 2 Position, 2.00mm, Through Hole, Press-Fit, Solder, Natural; Working Voltage: 100V; Current Rating: 2A; Contact Resistance: 20mR; Mated Stacking Heights: 8mm; Contact Post Length: 0.134inch; Insulation Resistance: 1MR; Gender: Male; Number of Contacts: 2; Pitch: 2mm; Series: PH; Insulation Height: 0.236inch; Contact Plating: Tin,Copper; Contact Mating Length: 0.13inch; Depth: 4.5mm; Contact Finish - Mating: TIN; Max Voltage Rating (DC): 100V; Lead Free: Lead Free; Max Current Rating: 2A; Flammability Rating: UL94 V-0; Contact Material: Brass; Housing Color: White; Mounting Technology: Through Hole; Max Voltage Rating (AC): 100V; Number of Rows: 1; Contact Shape: Square; Voltage Rating: 100V; Length: 5.9mm; Housing Material: Polyamide; Pins: 2; Termination: Press-Fit; Height: 9.4mm; Lead Pitch: 2mm; Connector Type: Header; Width: 4.5mm; Orientation: Straight; Fastening Type: Detent; Min Operating Temperature: -25°C; Insulation Material: Nylon; Max Operating Temperature: 85°C; Color: Natural; Reach SVHC Compliant: Yes; Number of Poles: 2; Packaging: Bulk; Contact Type: Male Pin; Number of Positions: 2; Insulation Color: Natural; Voltage Rating (AC): 100V
L1 = CMP-00675-2: FIXED IND 2.2UH 5.8A 29 MOHM; Shielding: Shielded; Install: POP; Saturation Current: 9A; Tolerance: 20%; Core Material: Metal; DC Resistance (DCR): 29mR; Test Frequency: 100kHz; Length: 0.205inch; RoHS Compliant: Yes; Min Operating Temperature: -55°C; Case/Package: Nonstandard; Packaging: Tape and Reel; Series: 0530CDMC/DS; Max Operating Temperature: 125°C; Current Rating: 5.8A; Width: 0.205inch; Height - Seated (Max): 0.118inch; Mounting Technology: Surface Mount
Q1 Q2 = CMP-00688-3: 30-V, N channel NexFET™ power MOSFET, single SON 3 mm x 3 mm, 6.4 mOhm 8-VSONP -55 to 150; Drain to Source Resistance: 5.3mR; Power Dissipation: 2.8W; Threshold Voltage: 1.4V; Drain to Source Breakdown Voltage: 30V; Max Power Dissipation: 53W; Turn-Off Delay Time: 20ns; Number of Channels: 1; Gate to Source Voltage (Vgs): 20V; Rds On Max: 4.8mR; Fall Time: 4ns; Input Capacitance: 2.31nF; Polarity: N-CHANNEL; Continuous Drain Current (ID): 19A; Rise Time: 31ns; Install: POP; Case/Package: VSON; Pins: 8; Max Operating Temperature: 150°C; Series: NexFET™; Lead Free: Lead Free; Min Operating Temperature: -55°C; Element Configuration: Single; Reach SVHC Compliant: No; RoHS Compliant: Yes; Packaging: Tape and Reel; Number of Elements: 1; Mounting Technology: Surface Mount; Turn-On Delay Time: 4ns; Contact Plating: Tin; Drain to Source Voltage (Vdss): 30V; Package Quantity: 250
R13 R22 R23 = CMP-00336-2: as R4 on sheet MCU and Sensors; Features: Moisture Resistant; Length: 1mm; REACH SVHC: No SVHC; RoHS Compliant: Yes; Military Standard: Not; Size Code: 0402; Series: RC; Width: 0.5mm; Lead Free: Lead Free; Max Operating Temperature: 155°C; Height: 0.32mm; Voltage Rating (DC): 50V; Construction: Rectangular; Packaging: Tape and Reel; Tolerance: 1%; Case Code (Metric): 1005; Case Code (Imperial): 0402; Number of Pins: 2; Resistor Type: Thick Film; Number of Terminations: 2; Termination: SMD/SMT; Min Operating Temperature: -55°C; Case/Package: 0402; Height - Seated (Max): 0.016inch; Depth: 0.5mm
  R13 R23: Resistance Tolerance: 1%
R14 = CMP-009-00016-1: Res General Purpose Thick Film 0402 100 Ohm 1% 1/16W ±200ppm/°C Molded SMD Paper T/R; Voltage Rating (DC): 50V; Power Rating: 62.5mW; Install: POP; Max Power Dissipation: 63mW; Temperature Coefficient: 100ppm/°C; Reach SVHC Compliant: No; Construction: Rectangular; Case/Package: 0402; Military Standard: Not; Lead Free: Lead Free; Number of Terminations: 2; Case Code (Metric): 1005; Pins: 2; Width: 0.5mm; Features: Moisture Resistant; Tolerance: 1%; Packaging: Tape and Reel; Depth: 0.5mm; Technology: THICK FILM; Series: RC; Min Operating Temperature: -55°C; Height: 0.32mm; RoHS Compliant: Yes; Max Operating Temperature: 155°C; Voltage Rating: 50V; Case Code (Imperial): 0402; Resistance Tolerance: 1%; Termination: SMD/SMT; Resistor Type: Thick Film; Length: 1mm
R15 = CMP-00687-2: SMD Chip Resistor, 330 Ohm, ± 1%, 63 mW, 0402 [1005 Metric], Thick Film, General Purpose; Temperature Coefficient: 100ppm/°C; Voltage Rating: 50V; Max Power Dissipation: 63mW; Power Rating: 62.5mW; Install: POP; Resistance Tolerance: 1%; Packaging: Tape and Reel; Technology: THICK FILM; RoHS Compliant: Yes; Construction: Rectangular; Military Standard: Not; Min Operating Temperature: -55°C; Case Code (Imperial): 0402; Height: 0.016inch; Series: RC; Package Quantity: 1; Depth: 0.5mm; Resistor Type: Thick Film; Reach SVHC Compliant: No; Case/Package: 0402; Tolerance: 1%; Termination: SMD/SMT; Length: 0.039inch; Max Operating Temperature: 155°C; Features: Moisture Resistant; Lead Free: Lead Free; Case Code (Metric): 1005; Number of Terminations: 2; Width: 0.02inch
R16 = CMP-00681-2: SMD Chip Resistor, 127 kOhm, ± 1%, 63 mW, 0402 [1005 Metric], Thick Film, General Purpose; Power Rating: 62.5mW; Voltage Rating: 50V; Max Power Dissipation: 63mW; Temperature Coefficient: 100ppm/°C; Install: POP; Min Operating Temperature: -55°C; Tolerance: 1%; Number of Terminations: 2; Contact Plating: Tin,Matte; Length: 0.039inch; RoHS Compliant: Yes; Height: 0.016inch; Voltage Rating (DC): 50V; Series: RC; Termination: SMD/SMT; Features: Moisture Resistant; Max Operating Temperature: 155°C; Lead Free: Lead Free; Case/Package: 0402; Package Quantity: 1; Case Code (Metric): 1005; Packaging: Tape and Reel; Case Code (Imperial): 0402; Width: 0.02inch
R17 R19 R20 = CMP-00351-1: Res General Purpose Thick Film 0402 100K Ohm 1% 1/16W ±100ppm/°C Molded SMD Paper T/R; Working Voltage: 50V; Install: POP; Power Rating: 63mW; Series: RC; Military Standard: Not; Case Code (Metric): 1005; Features: Moisture Resistant; Termination: SMD/SMT; Number of Terminations: 2; Temperature Coefficient: 100ppm/°C; Height: 0.016inch; Tolerance: 1%; Case/Package: 0402; Depth: 0.5mm; RoHS Compliant: Yes; Resistance Tolerance: 1%; Lead Free: Lead Free; Max Operating Temperature: 155°C; Min Operating Temperature: -55°C; Width: 0.02inch; Packaging: Tape and Reel; Technology: THICK FILM; Case Code (Imperial): 0402; Package Quantity: 1; REACH SVHC: No SVHC; Resistor Type: Thick Film; Max Power Dissipation: 63mW; Voltage Rating: 50V; Length: 0.039inch; Construction: Rectangular
R18 = CMP-00405-3: Res Thick Film 0402 2.2K Ohm 5% 1/10W +/-200ppm/ßC Molded SMD Punched Carrier T/R; Power Rating: 100mW; Voltage Rating (DC): 50V; Temperature Coefficient: 200ppm/°C; Install: POP; Weight: 2.8E-05oz; Height: 0.35mm; Min Operating Temperature: -55°C; Package Quantity: 10000; Size Code: 0402; Packaging: Tape and Reel; Military Standard: Not; Mount: Surface Mount; Max Power Dissipation: 100mW; Tolerance: 5%; Voltage Rating: 50V; RoHS Compliant: Yes; Resistance Tolerance: 5%; Resistor Type: Thick Film; Series: ERJ; Termination: SMD/SMT; Case/Package: 0402; Ratings: AEC-Q200; Case Code (Imperial): 0402; Max Operating Temperature: 155°C; Length: 1mm; Lead Free: Lead Free; Technology: THICK FILM; Features: Automotive AEC-Q200; Number of Terminations: 2; Reach SVHC Compliant: Yes; Radiation Hardening: No; Case Code (Metric): 1005; Width: 0.5mm; Depth: 0.5mm; Contact Plating: Tin; Construction: Rectangular
R21 = CMP-00815-1: SMD Chip Resistor, 10 Milliohm, ± 1%, 250 mW, 0603 [1608 Metric], Thick Film, High Power; Temperature Coefficient: 300ppm/°C; Install: POP; Max Power Dissipation: 250mW; Tolerance: 1%; Max Operating Temperature: 125°C; Case/Package: 0603; Case Code (Imperial): 0603; Packaging: Tape and Reel; Length: 0.063inch; Ratings: AEC-Q200; Package Quantity: 5000; Case Code (Metric): 1608; Lead Free: Lead Free; Width: 0.031inch; Features: Automotive AEC-Q200; RoHS Compliant: Yes; Min Operating Temperature: -55°C; Height: 0.026inch; Series: ERJ; Number of Terminations: 2
U4 = CMP-058-000000-7: I2C Controlled, 1-4 Cell, 5-A Buck-Boost Battery Charger with Dual-Input; Mfr_Name: Texas Instruments; Install: POP; TYPE: TYPE; Source: PQ25792RQMR.SchLib; Design Item ID: BQ25792RQMR; RefDes: RefDes; RoHS Compliant: Yes
U5 = CMP-00648-4: Battery Management 5.1 A 1-Cell Fuel Gauge with ModelGauge m5 EZ and Optional H; Install: POP; RoHS Compliant: Yes
U6 = CMP-00679-4: Li-Ion/Li Polymer Advanced Single-Cell Battery Protector IC Family 6-WSON -40 to 85; Operating Supply Voltage: 8V; Fault Protection: Over Current,Short Circuit,Over/Under Voltage; Number of Cells: 1; Install: POP; Packaging: Tape and Reel; Max Operating Temperature: 85°C; Lead Free: Lead Free; Contact Plating: Gold; Mounting Technology: Surface Mount; Series: -; Package Quantity: 3000; Pins: 6; Min Operating Temperature: -40°C; RoHS Compliant: Yes; Weight: 0.000342oz; Case/Package: WFDFN

## Sheet Revision History.SchDoc: Revision History
size 431 x 279 mm; DrawnBy: DD; DocumentNumber: GHL-1-21002; Revision: A; SheetNumber: 7; SheetTotal: 7; ProjectID: 263-03
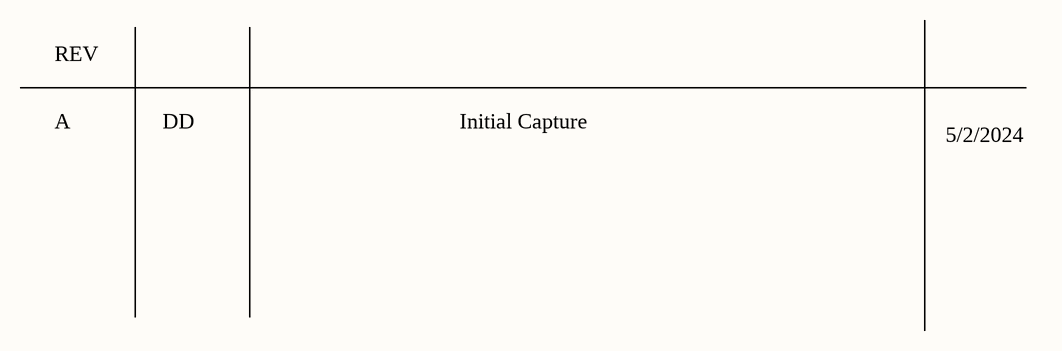
[diagram p3: Revision History.SchDoc]

### Notes on the sheet
- REV
- A
- DD
- Initial Capture
- 5/2/2024
- REVISION
- DESCRIPTION
- DATE
- APPROVED
- 295 Foster St
- PROJECT
- www.odic.com <http://www.odic.com>
- Littleton, MA
- 01460
- Suite 202
- TITLE
- DRAWN:
- CHECKED:
- APPROVALS
- SIZE
- B
- PROJECT ID
- DWG NO.
- SHEET
- OF
- APPROVED:
- FILE NAME